# Altium schematic sheet MCU_MKE185F512VLH16.SchDoc: Microcontroller
size A3; DrawnBy: Alvin Ha; DocumentNumber: MCU2018-2; Revision: 2.0; SheetNumber: 2; SheetTotal: 4
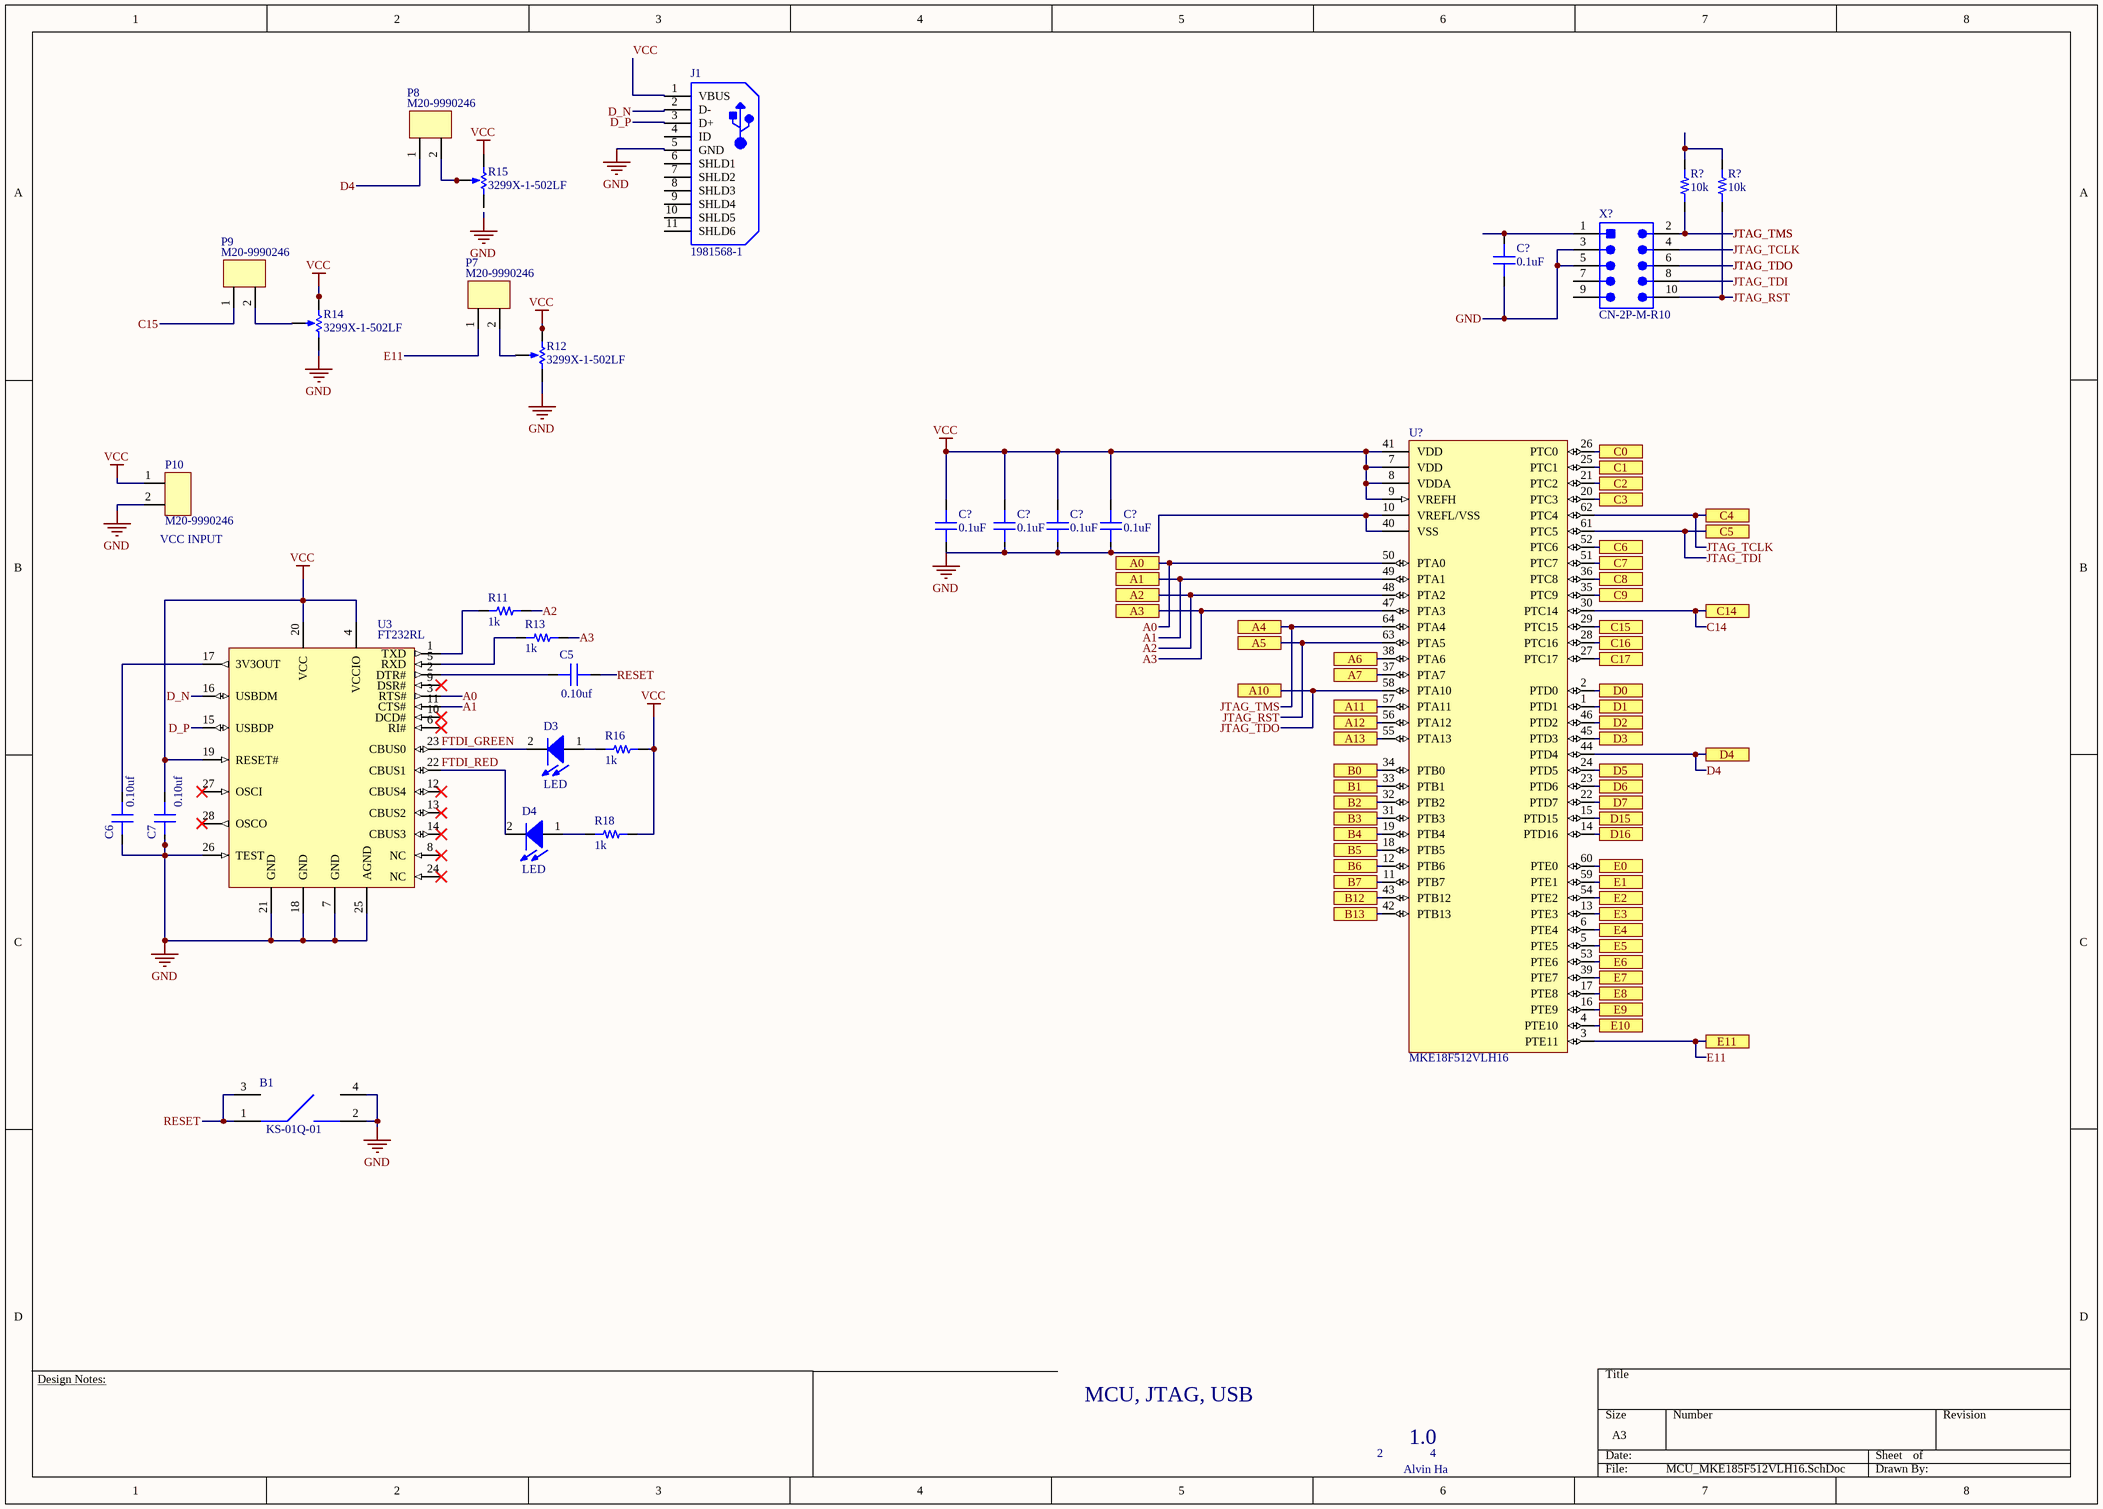
[diagram p0: MCU_MKE185F512VLH16.SchDoc]

## Parts
(Parts that share a designator on the sheet are numbered #1, #2 ... from top to bottom, then left to right.)
B1  KS-01Q-01  [KS-01Q-01]
C5  value 0.10uf  [CAP 0603/1608]  (hidden comment: Capacitor MLCC 0.10uf 25V CAP 0603/1608)
C6  value 0.10uf  [CAP 0603/1608]  (hidden comment: Capacitor MLCC 0.10uf 25V CAP 0603/1608)
C7  value 0.10uf  [CAP 0603/1608]  (hidden comment: Capacitor MLCC 0.10uf 25V CAP 0603/1608)
C?#1  capacitance: 0.1uF  [0603]  (hidden comment: capacitor)
C?#2  capacitance: 0.1uF  [0603]  (hidden comment: capacitor)
C?#3  capacitance: 0.1uF  [0603]  (hidden comment: capacitor)
C?#4  capacitance: 0.1uF  [0603]  (hidden comment: capacitor)
C?#5  capacitance: 0.1uF  [0603]  (hidden comment: capacitor)
D3  LED  [0805_LED]
D4  LED  [0805_LED]
J1  1981568-1  [TECO-1981568-5_V]
P7  M20-9990246  [M20-9990246]
P8  M20-9990246  [M20-9990246]
P9  M20-9990246  [M20-9990246]
P10  M20-9990246  [M20-9990246]
R11  1k  [RES 0603/1608]
R12  3299X-1-502LF  [3299X-1-502LF]
R13  1k  [RES 0603/1608]
R14  3299X-1-502LF  [3299X-1-502LF]
R15  3299X-1-502LF  [3299X-1-502LF]
R16  1k  [RES 0603/1608]
R18  1k  [RES 0603/1608]
R?#1  resistance: 10k  [0603]  (hidden comment: resistor)
R?#2  resistance: 10k  [0603]  (hidden comment: resistor)
U3  FT232RL  [SSOP-28]
U?  MKE18F512VLH16  [TQFP64]
X?  CN-2P-M-R10  [HDR2X5_SMT]

## Ports
A0, A1, A2, A3, A4, A5, A6, A7, A10, A11, A12, A13, B0, B1, B2, B3, B4, B5, B6, B7, B12, B13, C0, C1, C2, C3, C4, C5, C6, C7, C8, C9, C14, C15, C16, C17, D0, D1, D2, D3, D4, D5, D6, D7, D15, D16, E0, E1, E2, E3, E4, E5, E6, E7, E8, E9, E10, E11

## Nets
GND: B1.2 B1.4 C6.1 C7.1 C?#1.1 C?#2.1 C?#3.1 C?#4.1 C?#5.1 J1.5(GND) P10.2 R12.3(BOT) R14.3(BOT) U3.7(GND) U3.18(GND) U3.21(GND) U3.25(AGND) U3.26(TEST) U?.10(VREFL/VSS) U?.40(VSS) X?.3 X?.5
VCC: C7.2 C?#2.2 C?#3.2 C?#4.2 C?#5.2 J1.1(VBUS) P10.1 R12.1(TOP) R14.1(TOP) R15.1(TOP) R16.2 R18.2 U3.4(VCCIO) U3.19(RESET#) U3.20(VCC) U?.7(VDD) U?.8(VDDA) U?.9(VREFH) U?.41(VDD)
A0: U3.3(RTS#) U?.50(PTA0) ; port A0
A1: U3.11(CTS#) U?.49(PTA1) ; port A1
A2: R11.2 U?.48(PTA2) ; port A2
A3: R13.2 U?.47(PTA3) ; port A3
A6: U?.38(PTA6) ; port A6
A7: U?.37(PTA7) ; port A7
A11: U?.57(PTA11) ; port A11
A12: U?.56(PTA12) ; port A12
A13: U?.55(PTA13) ; port A13
B0: U?.34(PTB0) ; port B0
B1: U?.33(PTB1) ; port B1
B2: U?.32(PTB2) ; port B2
B3: U?.31(PTB3) ; port B3
B4: U?.19(PTB4) ; port B4
B5: U?.18(PTB5) ; port B5
B6: U?.12(PTB6) ; port B6
B7: U?.11(PTB7) ; port B7
B12: U?.43(PTB12) ; port B12
B13: U?.42(PTB13) ; port B13
C0: U?.26(PTC0) ; port C0
C1: U?.25(PTC1) ; port C1
C2: U?.21(PTC2) ; port C2
C3: U?.20(PTC3) ; port C3
C6: U?.52(PTC6) ; port C6
C7: U?.51(PTC7) ; port C7
C8: U?.36(PTC8) ; port C8
C9: U?.35(PTC9) ; port C9
C14: U?.30(PTC14) ; port C14
C15: P9.1
C15: U?.29(PTC15) ; port C15  [a separate net that carries the same name]
C16: U?.28(PTC16) ; port C16
C17: U?.27(PTC17) ; port C17
D0: U?.2(PTD0) ; port D0
D1: U?.1(PTD1) ; port D1
D2: U?.46(PTD2) ; port D2
D3: U?.45(PTD3) ; port D3
D4: P8.1 U?.44(PTD4) ; port D4
D5: U?.24(PTD5) ; port D5
D6: U?.23(PTD6) ; port D6
D7: U?.22(PTD7) ; port D7
D15: U?.15(PTD15) ; port D15
D16: U?.14(PTD16) ; port D16
D_N: J1.2(D-) U3.16(USBDM)
D_P: J1.3(D+) U3.15(USBDP)
E0: U?.60(PTE0) ; port E0
E1: U?.59(PTE1) ; port E1
E2: U?.54(PTE2) ; port E2
E3: U?.13(PTE3) ; port E3
E4: U?.6(PTE4) ; port E4
E5: U?.5(PTE5) ; port E5
E6: U?.53(PTE6) ; port E6
E7: U?.39(PTE7) ; port E7
E8: U?.17(PTE8) ; port E8
E9: U?.16(PTE9) ; port E9
E10: U?.4(PTE10) ; port E10
E11: P7.1 U?.3(PTE11) ; port E11
FTDI_GREEN: D3.2(K) U3.23(CBUS0)
FTDI_RED: D4.2(K) U3.22(CBUS1)
JTAG_RST: R?#2.1 U?.63(PTA5) X?.10 ; port A5
JTAG_TCLK: U?.62(PTC4) X?.4 ; port C4
JTAG_TDI: U?.61(PTC5) X?.8 ; port C5
JTAG_TDO: U?.58(PTA10) X?.6 ; port A10
JTAG_TMS: R?#1.1 U?.64(PTA4) X?.2 ; port A4
RESET: B1.1 B1.3 C5.2
NetC5_1: C5.1 U3.2(DTR#)
NetC6_2: C6.2 U3.17(3V3OUT)
NetC?#1_2: C?#1.2 X?.1
NetD3_1: D3.1(A) R16.1
NetD4_1: D4.1(A) R18.1
NetP8_2: P8.2 R15.2(TAP)
NetR11_1: R11.1 U3.1(TXD)
NetR13_1: R13.1 U3.5(RXD)
NetR?#1_2: R?#1.2 R?#2.2

Not connected (* = marked no-connect by the designer): J1 4(ID) 6(SHLD1) 7(SHLD2) 8(SHLD3) 9(SHLD4) 10(SHLD5) 11(SHLD6); P7 2; P9 2; R12 2(TAP); R14 2(TAP); R15 3(BOT); U3 6(RI#)* 8(NC)* 9(DSR#)* 10(DCD#)* 12(CBUS4)* 13(CBUS2)* 14(CBUS3)* 24(NC)* 27(OSCI)* 28(OSCO)*; X? 7 9

## Notes on the sheet
- (near P10) VCC INPUT
- MCU, JTAG, USB
- 1.0
- Design Notes:

## Library data of the parts
B1 = 7: RESET button; Manufacturer_id: 1; idTable: 7; Value: NULL; Num_Contacts: 4; Num_Rows: 2; Pitch: 5; Created_By: Austin; Drawer_id: 1; Name: KS-01Q-01; Voltage_Rating: Null; Package: NULL; MfrPartNo: KS-01Q-01; Link: https://www.digikey.com/product-detail/en/e-switch/KS-01Q-01/EG4791-ND/2116270; ComponentLink1Description: null; ComponentLink1URL: Null; Supplier1: e-switch; Supplier1PartNo: EG4791-ND; Created_Date: 12/15/2018; Updated_By: Null
C5-C7 = 583: Manufacturer_id: 1; idCapacitor: 583; Name: Cap_0.10uf_25V_CAP 0603/1608; Dielectric: Ceramic; Created_By: Nick Mah; Drawer_id: 1; Voltage_Rating: 25V; Package: CAP 0603/1608; Created_Date: 10/20/2018
C?#1-C?#5 = 1: Generic 0603 capacitor; id: 1; voltage: 50; dielectric: Ceramic; percent tolerance: 10; Name: 0603 Capacitor; ESR: 1; package: 0603; quantity: 0
D3 = 2: Manufacturer_id: 1; idLED: 2; Name: CMD17_0805_GREEN; Value: Green; Brightness: 7mcd; Id: 20mA; Vf: 2.1V; Drawer_id: 1; Link: https://www.digikey.com/product-detail/en/visual-communications-company-vcc/CMD17-21VGD-TR8/L62505CT-ND/254936; Package: 0805
D4 = 1: idLED: 1; Name: LED_0805_RED; Value: Red; Vf: 0.7V; Manufacturer_id: 1; Drawer_id: 1; Package: 0805
J1 = 5: USB Micro Type B; Manufacturer_id: 1; idConn: 5; Name: TE USB Micro; Value: CONN; Created_By: Aiku; MfrPartNo: 1981568-1; Drawer_id: 1; Num_Contacts: 5; Link: https://www.mouser.com/ProductDetail/TE-Connectivity-AMP/1981568-1?qs=sGAEpiMZZMulM8LPOQ%252bykzEIUPbUCiSfqsfxH3Oq%252bYo%3d; ComponentLink1Description: Datasheet; Supplier1: TE; Created_Date: 10/20/2018
P7-P10 = 25: 2 Pin VCC Power Header, Male; Manufacturer_id: 1; idConn: 25; Value: CONN; Voltage_Rating: Null; Num_Contacts: 2; Pitch: 2.54; Created_By: Austin; Drawer_id: 1; Name: M20-9990246; Num_Rows: Null; Package: Conn; MfrPartNo: M20-9990246; Link: https://www.digikey.com/product-detail/en/harwin-inc/M20-9990246/952-2262-ND/3728226; ComponentLink1Description: Null; ComponentLink1URL: https://www.digikey.com/product-detail/en/harwin-inc/M20-9990246/952-2262-ND/3728226; Supplier1: Digi-Key; Supplier1PartNo: 952-2262-ND; Created_Date: 12/15/2018; Updated_By: Null
R11 R13 R16 R18 = 1: id: 1; name: 0603 Resistor; percent tolerance: 5; resistance: 1k; package: 0603; quantity: 0
R12 R14 R15 = 6: Manufacturer_id: 1; idTable: 6; Value: 5K; Num_Contacts: 3; Pitch: 2.54mm; Drawer_id: 1; Name: 3299X-1-502LF; MfrPartNo: 3299X-1-502LF; Link: https://www.digikey.com/product-detail/en/bourns-inc/3299X-1-502LF/3299X-502LF-ND/1088167; ComponentLink1Description: Datasheet
R?#1 R?#2 = 1: id: 1; Name: 0603 Resistor; percent tolerance: 5; package: 0603; quantity: 0
U3 = 3: Manufacturer_id: 1; idIC_Interface: 3; Name: USB FTDI; Protocol: UART; Vin(Min): 3.3; Vin(Max): 5.25; Created_By: Kyle; Drawer_id: 1; MfrPartNo: FT232RL; Link: https://www.digikey.com/product-detail/en/ftdi-future-technology-devices-international-ltd/FT232RL-REEL/768-1007-1-ND/1836402
U? = 1: 32b NXP Microcontroller; id: 1; voltagemin: 2.70000004768372; voltagemax: 5.5; name: MKE18F512VLH16; package: TQFP64; quantity: 0
X? = 4: CONN_TE_2X5POS; id: 4; Name: 5103309-1; numcontacts: 10; numrows: 2; pitch: 2.54mm; MfrPartNo: *; link: https://www.digikey.com/product-detail/en/5103309-1/A33160-ND/1114898?utm_campaign=buynow&WT.z_cid=ref_octopart_dkc_buynow&utm_medium=aggregator&curr=usd&site=us&utm_source=octopart; quantity: 0